# Altium project Solar Tracker.PrjPcb
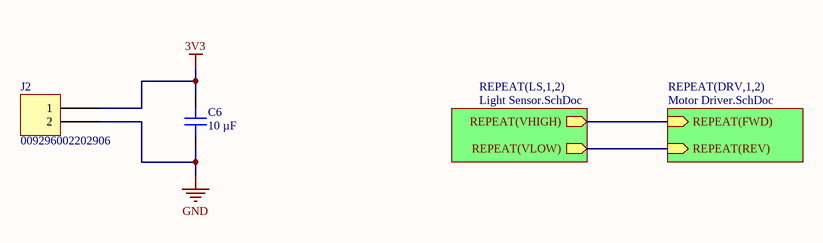
[diagram p0: Solar Tracker.SchDoc]
3 sheets, 56 parts. Net scope: hierarchical (ports join the sheet entries above them; power ports are global).
Board file: Solar Tracker.PcbDoc
Sheets:
  Solar Tracker.SchDoc
    LS1 = Light Sensor.SchDoc
    LS2 = Light Sensor.SchDoc
    DRV1 = Motor Driver.SchDoc
    DRV2 = Motor Driver.SchDoc

## Sheet Solar Tracker.SchDoc: Solar Tracker
size A4; SheetNumber: 1; SheetTotal: 3

### Parts
C6  10 µF  [CAP 1210_3225 - 1MM]
J2  009296002202906  [AVX 9296002202806]

### Sub-sheets
REPEAT(DRV,1,2) = Motor Driver.SchDoc: REPEAT(FWD) (in), REPEAT(REV) (in)
REPEAT(LS,1,2) = Light Sensor.SchDoc: REPEAT(VHIGH) (out), REPEAT(VLOW) (out)

### Nets
3V3: C6.2 J2.1
GND: C6.1 J2.2
(unnamed): sheet REPEAT(LS,1,2)/REPEAT(VHIGH), sheet REPEAT(DRV,1,2)/REPEAT(FWD)
(unnamed): sheet REPEAT(LS,1,2)/REPEAT(VLOW), sheet REPEAT(DRV,1,2)/REPEAT(REV)

### Notes on the sheet
- Title
- Size:
- Date:
- A4
- Number:
- Time:
- Revision:
- Sheet
- of
- File:

### Library data of the parts
C6 = CL32A106MOJNNNE: CAP CER 10UF 16V X5R 1210; manufacturer: Samsung Electro-Mechanics; Tolerance: ±20%; Part Number: CL32A106MOJNNNE; Value: 10 µF; Applications: General Purpose; Capacitance: 10 µF; componentlink1description: Datasheet; componentlink1url: http://www.samsungsem.com/kr/support/product-search/mlcc/CL32A106MOJNNNE.jsp; componentlink2description: DigiKey Link; componentlink2url: https://www.digikey.com/en/products/detail/samsung-electro-mechanics/CL32A106MOJNNNE/3888522; Device Package: 1210 (3225 Metric); lastupdated: 03/03/2022 14:36:33; Lifecycle Status: Active; Minimum Order: 1; Mounting Type: Surface Mount, MLCC; Operating Temperature: -55°C ~ 85°C; Package / Case: 1210 (3225 Metric); packaging: TapeAndReel; partid: 23713; Part Status: Active; price: 0.07; series: CL; Size / Dimension: 0.126" L x 0.098" W (3.20mm x 2.50mm); Supplier 1: DigiKey; Supplier Part Number 1: 1276-2864-1-ND; Temperature Coefficient: X5R; Thickness (Max): 0.106" (2.70mm); Voltage - Rated: 16V
J2 = 009296002202906: CONN WIRE POKE-IN 2POS SMD RA; Manufacturer: AVX Corporation; Board-Side Pitch: 0.118" (3.00mm); Connector Type: Individual Wires; Number of Positions: 2; Wire Gauge: 20-26 AWG; Part Number: 009296002202906; Cable Pitch: 0.118" (3.00mm); Cable Termination: Poke-In; Color: White; ComponentLink1Description: Datasheet; ComponentLink1URL: http://datasheets.avx.com/PHLPHorizontal_00-9296.pdf; ComponentLink2Description: DigiKey Link; ComponentLink2URL: http://digikey.com/product-detail/en/avx-corporation/009296002202906/478-9533-1-ND/5161727; Contact Finish: Tin; Features: Closed End; LastUpdated: 01/05/2020 07:29:21; Lifecycle Status: Active; Minimum Order: 1; Mounting Type: Surface Mount, Right Angle; Number of Rows: 1; Packaging: TapeAndReel; Part Status: Active; Price: 0.23; Series: 9296; Supplier 1: DigiKey; Supplier Part Number 1: 478-9533-1-ND

## Sheet Light Sensor.SchDoc: Solar Tracker - Light Sensor
size A4; SheetNumber: 2; SheetTotal: 3
Used 2 times, as channels LS1, LS2. Parts and nets are listed once, with the designators drawn on the sheet.
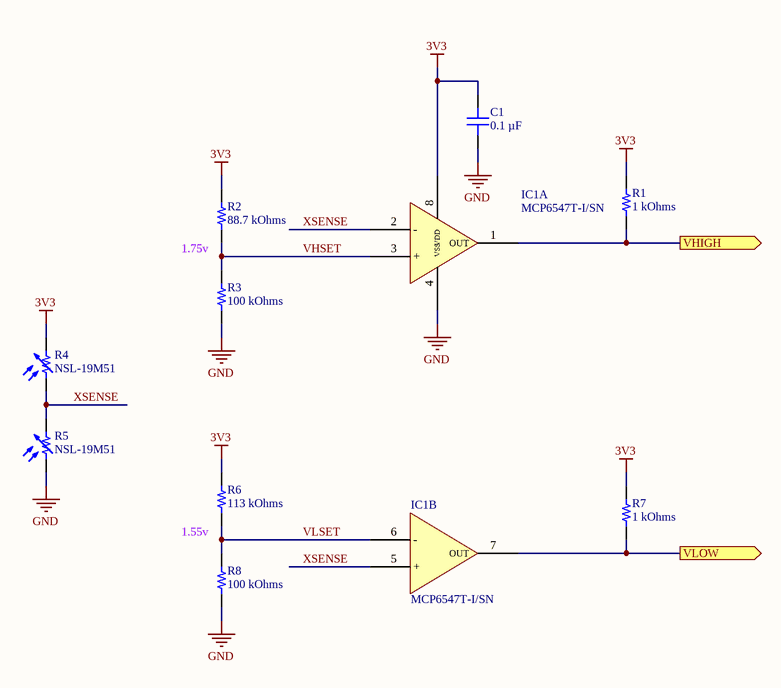
[diagram p1: Light Sensor.SchDoc]

### Parts
C1  0.1 µF  [CAP 0603_1608]
IC1  MCP6547T-I/SN  [MICROCHIP SOIC-8 SN]  (parts A,B of 2)
R1  1 kOhms  [RES 0603_1608]
R2  88.7 kOhms  [RES 0603_1608]
R3  100 kOhms  [RES 0603_1608]
R4  NSL-19M51  [ADVANCED PHOTONIX NSL-19M51]
R5  NSL-19M51  [ADVANCED PHOTONIX NSL-19M51]
R6  113 kOhms  [RES 0603_1608]
R7  1 kOhms  [RES 0603_1608]
R8  100 kOhms  [RES 0603_1608]

### Ports
VHIGH (out), VLOW (out)

### Nets
3V3: C1.2 IC1.8(VDD) R1.2 R2.2 R4.2 R6.2 R7.2
GND: C1.1 IC1.4(VSS) R3.1 R5.1 R8.1
VHIGH: IC1.1(OUT) R1.1 ; port VHIGH
VHSET: IC1.3(+) R2.1 R3.2
VLOW: IC1.7(OUT) R7.1 ; port VLOW
VLSET: IC1.6(-) R6.1 R8.2
XSENSE: IC1.2(-) IC1.5(+) R4.1 R5.2

### Channels
LS1: designators end in _LS1; ports VHIGH=NetIC1_LS1_1 VLOW=NetIC1_LS1_7
LS2: designators end in _LS2; ports VHIGH=NetIC1_LS2_1 VLOW=NetIC1_LS2_7

### Notes on the sheet
- 1.75v
- 1.55v
- Title
- Size:
- Date:
- A4
- Number:
- Time:
- Revision:
- Sheet
- of
- File:

### Library data of the parts
C1 = C0603C104K5RAC7411: CAP CER 0.1UF 50V X7R 0603; manufacturer: KEMET; Tolerance: ±10%; Part Number: C0603C104K5RAC7411; Value: 0.1 µF; Applications: Bypass, Decoupling; Capacitance: 0.1 µF; componentlink1description: Datasheet; componentlink1url: https://api.kemet.com/component-edge/download/datasheet/C0603C104K5RAC7411.pdf; componentlink2description: DigiKey Link; componentlink2url: https://www.digikey.com/en/products/detail/kemet/C0603C104K5RAC7411/3317013; Device Package: 0603 (1608 Metric); lastupdated: 28/02/2022 16:36:23; Lifecycle Status: Active; Minimum Order: 15000; Mounting Type: Surface Mount, MLCC; Operating Temperature: -55°C ~ 125°C; Package / Case: 0603 (1608 Metric); packaging: TapeAndReel; partid: 2233; Part Status: Active; price: 0.01; series: SMD Comm X7R; Size / Dimension: 0.063" L x 0.031" W (1.60mm x 0.80mm); Supplier 1: DigiKey; Supplier Part Number 1: 399-7374-2-ND; Temperature Coefficient: X7R; Thickness (Max): 0.035" (0.90mm); Voltage - Rated: 50V
IC1 = MCP6547T-I/SN: IC COMP OPENDRN 1.6V DUAL 8-SOIC; Manufacturer: Microchip Technology; CMRR, PSRR (Typ): 70dB CMRR, 80dB PSRR; Current - Input Bias (Max): 1pA @ 5.5V; Current - Output (Typ): 30mA; Current - Quiescent (Max): 1µA; Hysteresis: 6.5mV; Number of Elements: 2; Output Type: CMOS, Open-Drain, Rail-to-Rail, TTL; Propagation Delay (Max): 8µs; Voltage - Input Offset (Max): 7mV @ 5.5V; Voltage - Supply, Single/Dual (±): 1.6V ~ 5.5V; Part Number: MCP6547T-I/SN; ComponentLink1Description: Datasheet; ComponentLink1URL: http://www.microchip.com/mymicrochip/filehandler.aspx?ddocname=en020853; ComponentLink2Description: DigiKey Link; ComponentLink2URL: https://www.digikey.com/en/products/detail/microchip-technology/MCP6547T-I-SN/458458; LastUpdated: 02/03/2022 20:22:27; Lifecycle Status: Active; Minimum Order: 1; Mounting Type: Surface Mount; Operating Temperature: -40°C ~ 85°C; Package / Case: 8-SOIC (0.154", 3.90mm Width); Packaging: TapeAndReel; Part Status: Active; Price: 0.53; Series: -; Supplier 1: DigiKey; Supplier Part Number 1: MCP6547T-I/SNCT-ND; Supplier Device Package: 8-SOIC; Type: General Purpose
R1 R7 = ERJ-PA3J102V: RES SMD 1K OHM 5% 1/4W 0603; Manufacturer: Panasonic Electronic Components; Power (Watts): 0.25W, 1/4W; Temperature Coefficient: ±200ppm/°C; Part Number: ERJ-PA3J102V; Value: 1 kOhms; ComponentLink1Description: Datasheet; ComponentLink1URL: https://industrial.panasonic.com/cdbs/www-data/pdf/RDO0000/AOA0000C331.pdf; ComponentLink2Description: DigiKey Link; ComponentLink2URL: https://www.digikey.com/en/products/detail/panasonic-electronic-components/ERJ-PA3J102V/5035970; Composition: Thick Film; Device Package: 0603 (1608 Metric); Features: Automotive AEC-Q200, Pulse Withstanding; Height - Seated (Max): 0.022" (0.55mm); LastUpdated: 28/02/2022 16:15:56; Lifecycle Status: Active; Minimum Order: 1; Number of Terminations: 2; Operating Temperature: -55°C ~ 155°C; Package / Case: 0603 (1608 Metric); Packaging: TapeAndReel; PartId: 17507; Part Status: Active; Price: 0.01; Ratings: AEC-Q200; Resistance: 1 kOhms; Series: ERJ-PA3; Size / Dimension: 0.063" L x 0.031" W (1.60mm x 0.80mm); Supplier 1: DigiKey; Supplier Part Number 1: P1KBZCT-ND; Supplier Device Package: 0603; Tolerance: ±5%
R2 = RC0603FR-0788K7L: RES 88.7K OHM 1% 1/10W 0603; Manufacturer: Yageo; Power (Watts): 0.1W, 1/10W; Temperature Coefficient: ±100ppm/°C; Part Number: RC0603FR-0788K7L; Value: 88.7 kOhms; ComponentLink1Description: Datasheet; ComponentLink1URL: https://www.yageo.com/upload/media/product/productsearch/datasheet/rchip/PYu-RC_Group_51_RoHS_L_10.pdf; ComponentLink2Description: DigiKey Link; ComponentLink2URL: https://www.digikey.com/en/products/detail/yageo/RC0603FR-0788K7L/727415; Composition: Thick Film; Device Package: 0603 (1608 Metric); Features: Moisture Resistant; Height - Seated (Max): 0.022" (0.55mm); LastUpdated: 28/02/2022 16:16:25; Lifecycle Status: Active; Minimum Order: 1; Number of Terminations: 2; Operating Temperature: -55°C ~ 155°C; Package / Case: 0603 (1608 Metric); Packaging: CutTape; PartId: 7595; Part Status: Active; Price: 0.01; Resistance: 88.7 kOhms; Series: RC_L; Size / Dimension: 0.063" L x 0.031" W (1.60mm x 0.80mm); Supplier 1: DigiKey; Supplier Part Number 1: 311-88.7KHRCT-ND; Supplier Device Package: 0603; Tolerance: ±1%
R3 R8 = ERJ-PA3F1003V: RES SMD 100K OHM 1% 1/4W 0603; Manufacturer: Panasonic Electronic Components; Power (Watts): 0.25W, 1/4W; Temperature Coefficient: ±100ppm/°C; Part Number: ERJ-PA3F1003V; Value: 100 kOhms; ComponentLink1Description: Datasheet; ComponentLink1URL: https://industrial.panasonic.com/cdbs/www-data/pdf/RDO0000/AOA0000C331.pdf; ComponentLink2Description: DigiKey Link; ComponentLink2URL: https://www.digikey.com/en/products/detail/panasonic-electronic-components/ERJ-PA3F1003V/5035850; Composition: Thick Film; Device Package: 0603 (1608 Metric); Features: Automotive AEC-Q200, Pulse Withstanding; Height - Seated (Max): 0.022" (0.55mm); LastUpdated: 28/02/2022 16:16:03; Lifecycle Status: Active; Minimum Order: 1; Number of Terminations: 2; Operating Temperature: -55°C ~ 155°C; Package / Case: 0603 (1608 Metric); Packaging: TapeAndReel; PartId: 14879; Part Status: Active; Price: 0.02; Ratings: AEC-Q200; Resistance: 100 kOhms; Series: ERJ-PA3; Size / Dimension: 0.063" L x 0.031" W (1.60mm x 0.80mm); Supplier 1: DigiKey; Supplier Part Number 1: P100KBYCT-ND; Supplier Device Package: 0603; Tolerance: ±1%
R4 R5 = NSL-19M51: PHOTOCELL; Manufacturer: Advanced Photonix; Cell Resistance @ Illuminance: 20 ~ 100kOhms @ 10 lux; Cell Resistance (Min) @ Dark: 20 MOhms @ 10 s; Voltage - Max: 100Vpk; Wavelength: 550nm; Part Number: NSL-19M51; ComponentLink1Description: Datasheet; ComponentLink1URL: https://lunainc.com/wp-content/uploads/2016/06/NSL-19M51.pdf; ComponentLink2Description: DigiKey Link; ComponentLink2URL: https://www.digikey.com/en/products/detail/advanced-photonix/NSL-19M51/5039794; Device Package: Radial; LastUpdated: 03/03/2022 12:53:42; Lifecycle Status: Active; Minimum Order: 1; Mounting Type: Through Hole; Operating Temperature: -60°C ~ 75°C (TA); Package / Case: Radial; Packaging: Bulk; Part Status: Active; Price: 0.61; Series: -; Supplier 1: DigiKey; Supplier Part Number 1: NSL-19M51-ND; Supplier Device Package: TO-18
R6 = RMCF0603FT113K: RES 113K OHM 1% 1/10W 0603; Manufacturer: Stackpole Electronics Inc; Power (Watts): 0.1W, 1/10W; Temperature Coefficient: ±100ppm/°C; Part Number: RMCF0603FT113K; Value: 113 kOhms; ComponentLink1Description: Datasheet; ComponentLink1URL: https://www.seielect.com/catalog/sei-rmcf_rmcp.pdf; ComponentLink2Description: DigiKey Link; ComponentLink2URL: https://www.digikey.com/en/products/detail/stackpole-electronics-inc/RMCF0603FT113K/1713567; Composition: Thick Film; Device Package: 0603 (1608 Metric); Features: Automotive AEC-Q200; Height - Seated (Max): 0.022" (0.55mm); LastUpdated: 28/02/2022 16:16:02; Lifecycle Status: Active; Minimum Order: 1; Number of Terminations: 2; Operating Temperature: -55°C ~ 155°C; Package / Case: 0603 (1608 Metric); Packaging: CutTape; PartId: 15681; Part Status: Active; Price: 0.01; Ratings: AEC-Q200; Resistance: 113 kOhms; Series: RMCF; Size / Dimension: 0.061" L x 0.031" W (1.55mm x 0.80mm); Supplier 1: DigiKey; Supplier Part Number 1: RMCF0603FT113KCT-ND; Supplier Device Package: 0603; Tolerance: ±1%

## Sheet Motor Driver.SchDoc: Solar Tracker - Motor Driver
size A4; SheetNumber: 3; SheetTotal: 3
Used 2 times, as channels DRV1, DRV2. Parts and nets are listed once, with the designators drawn on the sheet.
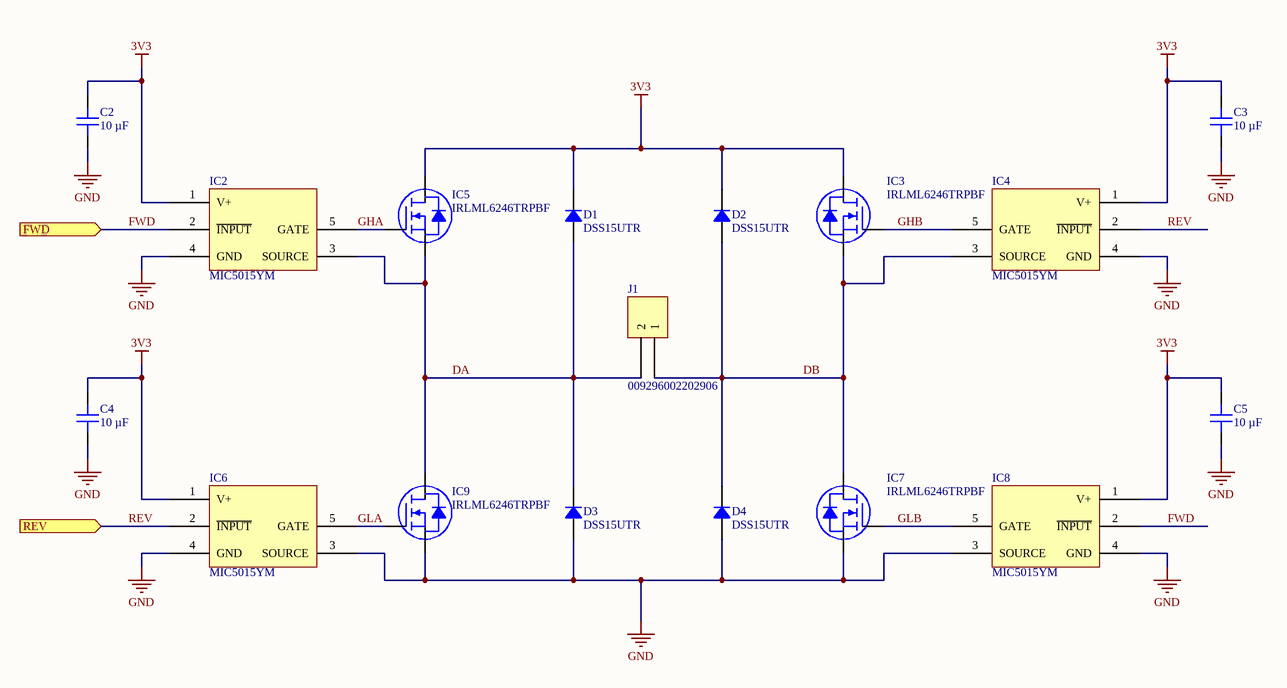
[diagram p2: Motor Driver.SchDoc]

### Parts
C2  10 µF  [CAP 1210_3225 - 1MM]
C3  10 µF  [CAP 1210_3225 - 1MM]
C4  10 µF  [CAP 1210_3225 - 1MM]
C5  10 µF  [CAP 1210_3225 - 1MM]
D1  DSS15UTR  [SOD123F]
D2  DSS15UTR  [SOD123F]
D3  DSS15UTR  [SOD123F]
D4  DSS15UTR  [SOD123F]
IC2  MIC5015YM  [MICROCHIP MICREL SOP-8 M]
IC3  IRLML6246TRPBF  [INFINEON SOT-23-3]
IC4  MIC5015YM  [MICROCHIP MICREL SOP-8 M]
IC5  IRLML6246TRPBF  [INFINEON SOT-23-3]
IC6  MIC5015YM  [MICROCHIP MICREL SOP-8 M]
IC7  IRLML6246TRPBF  [INFINEON SOT-23-3]
IC8  MIC5015YM  [MICROCHIP MICREL SOP-8 M]
IC9  IRLML6246TRPBF  [INFINEON SOT-23-3]
J1  009296002202906  [AVX 9296002202806]

### Ports
FWD (in), REV (in)

### Nets
3V3: C2.2 C3.2 C4.2 C5.2 D1.2 D2.2 IC2.1(V+) IC3.3(D) IC4.1(V+) IC5.3(D) IC6.1(V+) IC8.1(V+)
GND: C2.1 C3.1 C4.1 C5.1 D3.1 D4.1 IC2.4(GND) IC4.4(GND) IC6.3(SOURCE) IC6.4(GND) IC7.2(S) IC8.3(SOURCE) IC8.4(GND) IC9.2(S)
DA: D1.1 D3.2 IC2.3(SOURCE) IC5.2(S) IC9.3(D) J1.2
DB: D2.1 D4.2 IC3.2(S) IC4.3(SOURCE) IC7.3(D) J1.1
FWD: IC2.2(~{INPUT}) IC8.2(~{INPUT}) ; port FWD
GHA: IC2.5(GATE) IC5.1(G)
GHB: IC3.1(G) IC4.5(GATE)
GLA: IC6.5(GATE) IC9.1(G)
GLB: IC7.1(G) IC8.5(GATE)
REV: IC4.2(~{INPUT}) IC6.2(~{INPUT}) ; port REV

### Channels
DRV1: designators end in _DRV1; ports FWD=FWD_DRV1 REV=REV_DRV1
DRV2: designators end in _DRV2; ports FWD=FWD_DRV2 REV=REV_DRV2

### Notes on the sheet
- Title
- Size:
- Date:
- A4
- Number:
- Time:
- Revision:
- Sheet
- of
- File:

### Library data of the parts
C2-C5 = CL32A106MOJNNNE: as C6 on sheet Solar Tracker; Part Number: CL32A106MOJNNNE; Value: 10 µF; Applications: General Purpose; Capacitance: 10 µF; componentlink1description: Datasheet; componentlink1url: http://www.samsungsem.com/kr/support/product-search/mlcc/CL32A106MOJNNNE.jsp; componentlink2description: DigiKey Link; componentlink2url: https://www.digikey.com/en/products/detail/samsung-electro-mechanics/CL32A106MOJNNNE/3888522; Device Package: 1210 (3225 Metric); lastupdated: 03/03/2022 14:36:33; Lifecycle Status: Active; Minimum Order: 1; Mounting Type: Surface Mount, MLCC; Operating Temperature: -55°C ~ 85°C; Package / Case: 1210 (3225 Metric); packaging: TapeAndReel; partid: 23713; Part Status: Active; price: 0.07; series: CL; Size / Dimension: 0.126" L x 0.098" W (3.20mm x 2.50mm); Supplier 1: DigiKey; Supplier Part Number 1: 1276-2864-1-ND; Temperature Coefficient: X5R; Thickness (Max): 0.106" (2.70mm); Voltage - Rated: 16V
D1-D4 = DSS15UTR: SCHOTTKY 50V SOD-123FL; Manufacturer: SMC Diode Solutions; Capacitance @ Vr, F: 110pF @ 4V, 1MHz; Current - Average Rectified (Io): 1A; Current - Reverse Leakage @ Vr: 100 µA @ 50 V; Speed: Fast Recovery =< 500ns, > 200mA (Io); Voltage - Forward (Vf) (Max) @ If: 670 mV @ 1 A; Part Number: DSS15UTR; ComponentLink1Description: Datasheet; ComponentLink1URL: http://www.smc-diodes.com/propdf/DSS12U%20THRU%20DSS125U%20N1873%20REV.A.pdf; ComponentLink2Description: DigiKey Link; ComponentLink2URL: https://www.digikey.com/en/products/detail/smc-diode-solutions/DSS15UTR/8341860; Diode Type: Schottky; LastUpdated: 03/03/2022 14:49:54; Lifecycle Status: Active; Minimum Order: 1; Mounting Type: Surface Mount; Operating Temperature - Junction: -55°C ~ 150°C; Package / Case: SOD-123F; Packaging: TapeAndReel; PartId: 2511; Part Status: Active; Price: 0.03; Series: -; Supplier 1: DigiKey; Supplier Part Number 1: 1655-1928-1-ND; Supplier Device Package: SOD-123FL; Voltage - DC Reverse (Vr) (Max): 50 V
IC2 IC4 IC6 IC8 = MIC5015YM: IC GATE DRVR HI/LOW SIDE 8SOIC; Manufacturer: Microchip Technology; Channel Type: Single; Driven Configuration: High-Side or Low-Side; Gate Type: N-Channel MOSFET; Input Type: Inverting; Logic Voltage - VIL, VIH: 0.8V, 2V; Number of Drivers: 1; Voltage - Supply: 2.75V ~ 30V; Part Number: MIC5015YM; ComponentLink1Description: Datasheet; ComponentLink1URL: http://ww1.microchip.com/downloads/en/DeviceDoc/mic5014.pdf; ComponentLink2Description: DigiKey Link; ComponentLink2URL: https://www.digikey.com/en/products/detail/microchip-technology/MIC5015YM/771704; LastUpdated: 03/03/2022 15:47:18; Lifecycle Status: Active; Minimum Order: 1; Mounting Type: Surface Mount; Operating Temperature: -40°C ~ 150°C (TJ); Package / Case: 8-SOIC (0.154", 3.90mm Width); Packaging: Tube; PartId: 15; Part Status: Active; Price: 2.00; Series: -; Supplier 1: DigiKey; Supplier Part Number 1: 576-1235-ND; Supplier Device Package: 8-SOIC
IC3 IC5 IC7 IC9 = IRLML6246TRPBF: MOSFET N-CH 20V 4.1A SOT-23; Manufacturer: Infineon Technologies; Current - Continuous Drain (Id) @ 25°C: 4.1A (Ta); Drive Voltage (Max Rds On,  Min Rds On): 2.5V, 4.5V; FET Type: N-Channel; Gate Charge (Qg) (Max) @ Vgs: 3.5nC @ 4.5V; Input Capacitance (Ciss) (Max) @ Vds: 290pF @ 16V; Power Dissipation (Max): 1.3W (Ta); Rds On (Max) @ Id, Vgs: 46mOhm @ 4.1A, 4.5V; Vgs (Max): ±12V; Vgs(th) (Max) @ Id: 1.1V @ 5µA; Part Number: IRLML6246TRPBF; ComponentLink1Description: Datasheet; ComponentLink1URL: https://www.infineon.com/dgdl/irlml6246pbf.pdf?fileId=5546d462533600a40153566878f22621; ComponentLink2Description: DigiKey Link; ComponentLink2URL: http://digikey.com/product-detail/en/infineon-technologies/IRLML6246TRPBF/IRLML6246TRPBFCT-ND/2393880; Drain to Source Voltage (Vdss): 20V; LastUpdated: 02/09/2020 01:25:05; Lifecycle Status: Active; Minimum Order: 1; Mounting Type: Surface Mount; Operating Temperature: -55°C ~ 150°C (TJ); Package / Case: TO-236-3, SC-59, SOT-23-3; Packaging: TapeAndReel; Part Status: Active; Price: 0.09; Series: HEXFET®; Supplier 1: DigiKey; Supplier Part Number 1: IRLML6246TRPBFCT-ND; Supplier Device Package: Micro3™/SOT-23; Technology: MOSFET (Metal Oxide)
J1 = 009296002202906: as J2 on sheet Solar Tracker; Part Number: 009296002202906; Cable Pitch: 0.118" (3.00mm); Cable Termination: Poke-In; Color: White; ComponentLink1Description: Datasheet; ComponentLink1URL: http://datasheets.avx.com/PHLPHorizontal_00-9296.pdf; ComponentLink2Description: DigiKey Link; ComponentLink2URL: http://digikey.com/product-detail/en/avx-corporation/009296002202906/478-9533-1-ND/5161727; Contact Finish: Tin; Features: Closed End; LastUpdated: 01/05/2020 07:29:21; Lifecycle Status: Active; Minimum Order: 1; Mounting Type: Surface Mount, Right Angle; Number of Rows: 1; Packaging: TapeAndReel; Part Status: Active; Price: 0.23; Series: 9296; Supplier 1: DigiKey; Supplier Part Number 1: 478-9533-1-ND

## Nets that join several sheets
3V3: Solar Tracker (C6.2 J2.1), LS1 (7 pins), LS2 (7 pins), DRV1 (12 pins), DRV2 (12 pins)
GND: Solar Tracker (C6.1 J2.2), LS1 (5 pins), LS2 (5 pins), DRV1 (14 pins), DRV2 (14 pins)